# Altium project Switch.PrjPcb
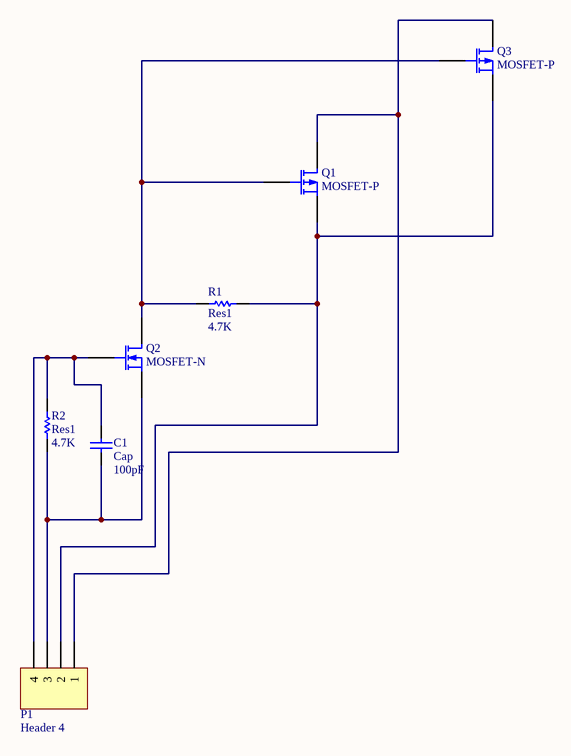
[diagram p0: Main.SchDoc]
1 sheet, 7 parts. Net scope: global (net labels, ports and power ports of the same name join across sheets).
Board files: Main.PcbDoc, PCB1.PcbDoc

## Sheet Main.SchDoc
size A4

### Parts
C1  Cap  value 100pF  [0603]
P1  Header 4  [HDR1X4]
Q1  MOSFET-P  [SOT23-3-PMOS]
Q2  MOSFET-N  [SOT23-3-PMOS]
Q3  MOSFET-P  [D2PAK]
R1  Res1  value 4.7K  [0603]
R2  Res1  value 4.7K  [0603]

### Nets
NetC1_1: C1.1 P1.3 Q2.3(S) R2.1
NetC1_2: C1.2 P1.4 Q2.2(G) R2.2
NetP1_1: P1.1 Q1.1(D) Q3.1(D)
NetP1_2: P1.2 Q1.3(S) Q3.3(S) R1.1
NetQ1_2: Q1.2(G) Q2.1(D) Q3.2(G) R1.2

### Library data of the parts
C1 = Cap: Capacitor; Published: 8-Jun-2000; LatestRevisionDate: 17-Jul-2002; LatestRevisionNote: Re-released for DXP Platform.; PackageReference: RAD-0.3; Publisher: Altium Limited; PackageDescription: Radial Cap, Thru-Hole; 2 Leads; 0.3 in Pin Spacing
P1 = Header 4: Header, 4-Pin; LatestRevisionDate: 17-Jul-2002; LatestRevisionNote: Re-released for DXP Platform.; Publisher: Altium Limited
Q1 Q3 = MOSFET-P: P-Channel MOSFET; Published: 8-Jun-2000; LatestRevisionDate: 17-Jul-2002; LatestRevisionNote: Re-released for DXP Platform.; PackageVersion: 1995/1996; PackageReference: E3; Publisher: Altium Limited; PackageDescription: TO, Flat Index; 3 In-Line, Axial Leads; Body Dia. 4.6mm; Lead Dia. 0.5 mm (max)
Q2 = MOSFET-N: N-Channel MOSFET; Published: 8-Jun-2000; LatestRevisionDate: 17-Jul-2002; LatestRevisionNote: Re-released for DXP Platform.; PackageVersion: 1995/1996; PackageReference: E3; Publisher: Altium Limited; PackageDescription: TO, Flat Index; 3 In-Line, Axial Leads; Body Dia. 4.6mm; Lead Dia. 0.5 mm (max)
R1 R2 = Res1: Resistor; Published: 8-Jun-2000; LatestRevisionDate: 17-Jul-2002; LatestRevisionNote: Re-released for DXP Platform.; PackageReference: AXIAL-0.3; Publisher: Altium Limited; PackageDescription: Axial Device, Thru-Hole; 2 Leads; 0.3 in Pin Spacing